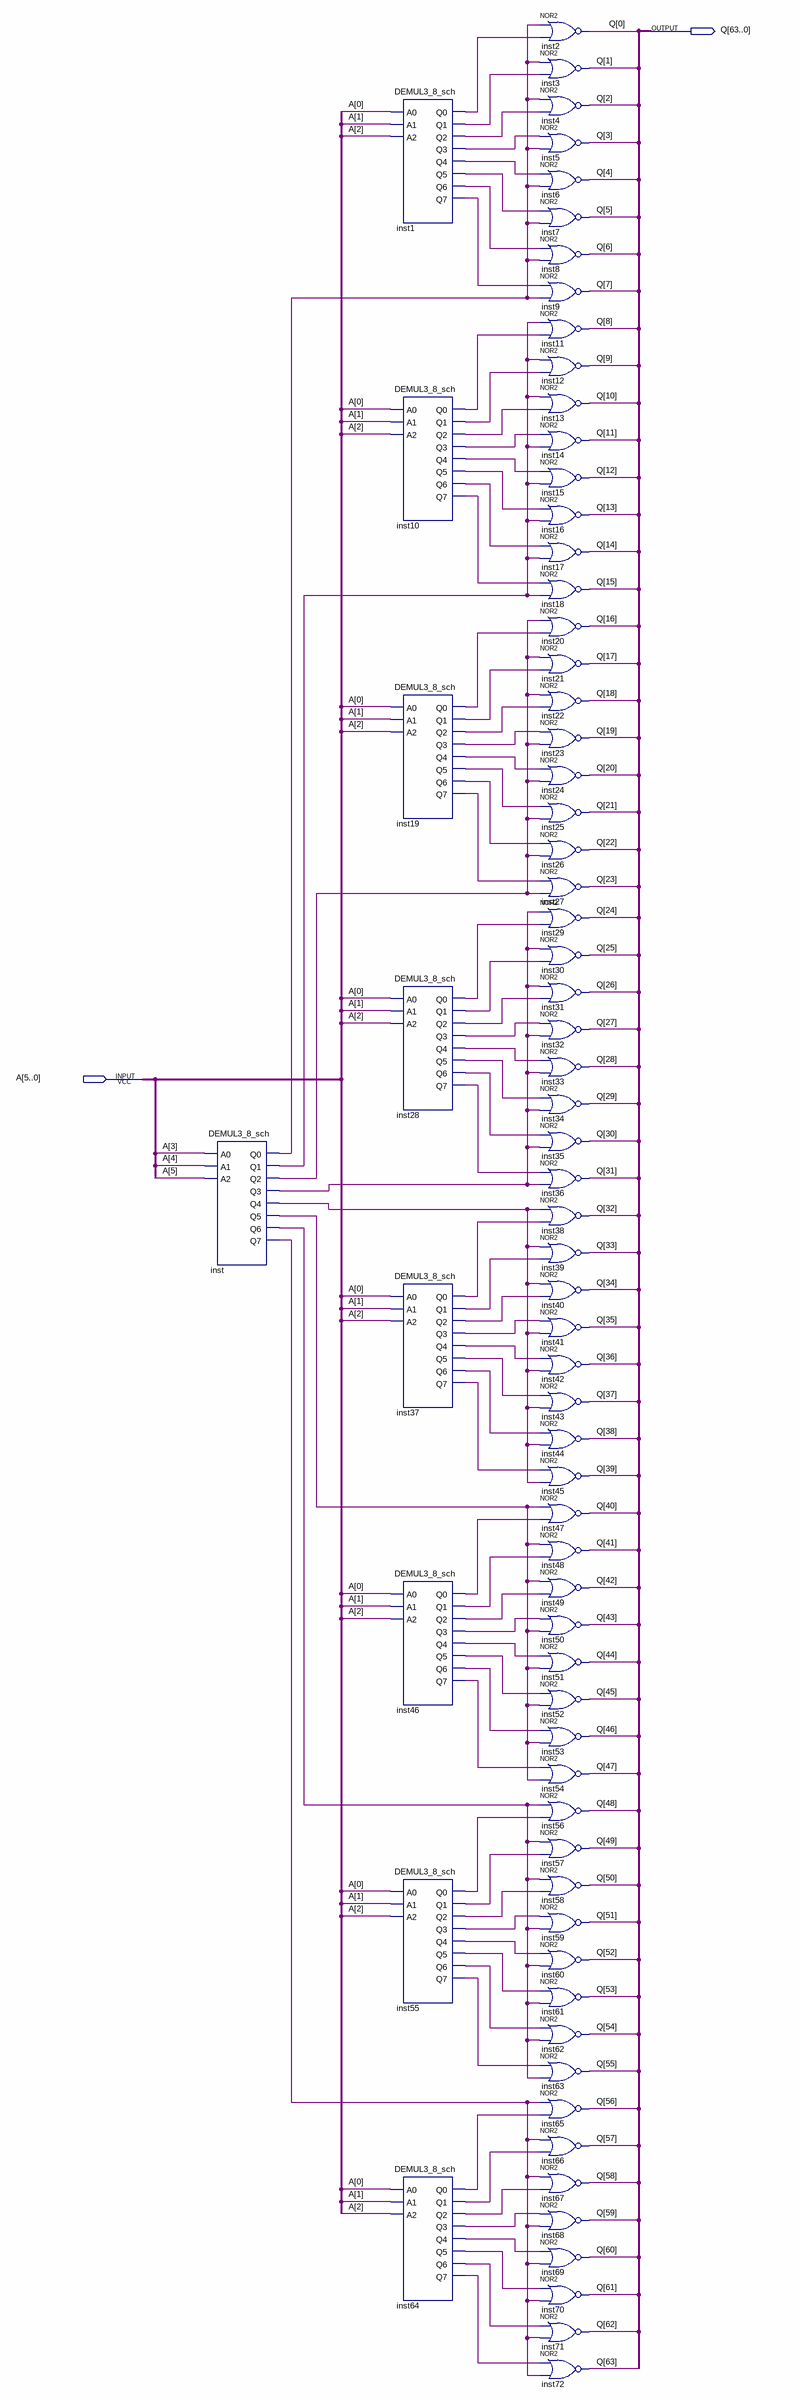
[diagram p0: schematic sheet]
// Quartus schematic Decoder_6_64.bdf as structural Verilog: 73 symbols, 2 pins
module Decoder_6_64 (
  input  [5:0] A,
  output [63:0] Q
);

  wire inst1_q0, inst1_q1, inst1_q2, inst1_q3, inst1_q4, inst1_q5, inst1_q6, inst1_q7, inst10_q0, inst10_q1,
       inst10_q2, inst10_q3, inst10_q4, inst10_q5, inst10_q6, inst10_q7, inst19_q0, inst19_q1, inst19_q2,
       inst19_q3, inst19_q4, inst19_q5, inst19_q6, inst19_q7, inst28_q0, inst28_q1, inst28_q2, inst28_q3,
       inst28_q4, inst28_q5, inst28_q6, inst28_q7, inst37_q0, inst37_q1, inst37_q2, inst37_q3, inst37_q4,
       inst37_q5, inst37_q6, inst37_q7, inst46_q0, inst46_q1, inst46_q2, inst46_q3, inst46_q4, inst46_q5,
       inst46_q6, inst46_q7, inst55_q0, inst55_q1, inst55_q2, inst55_q3, inst55_q4, inst55_q5, inst55_q6,
       inst55_q7, inst64_q0, inst64_q1, inst64_q2, inst64_q3, inst64_q4, inst64_q5, inst64_q6, inst64_q7,
       inst_q0, inst_q1, inst_q2, inst_q3, inst_q4, inst_q5, inst_q6, inst_q7;

  DEMUL3_8_sch inst (
    .A0(A[3]), .A1(A[4]), .A2(A[5]), .Q0(inst_q0), .Q1(inst_q1), .Q2(inst_q2), .Q3(inst_q3), .Q4(inst_q4),
    .Q5(inst_q5), .Q6(inst_q6), .Q7(inst_q7));
  DEMUL3_8_sch inst1 (
    .A0(A[0]), .A1(A[1]), .A2(A[2]), .Q0(inst1_q0), .Q1(inst1_q1), .Q2(inst1_q2), .Q3(inst1_q3),
    .Q4(inst1_q4), .Q5(inst1_q5), .Q6(inst1_q6), .Q7(inst1_q7));
  DEMUL3_8_sch inst10 (
    .A0(A[0]), .A1(A[1]), .A2(A[2]), .Q0(inst10_q0), .Q1(inst10_q1), .Q2(inst10_q2), .Q3(inst10_q3),
    .Q4(inst10_q4), .Q5(inst10_q5), .Q6(inst10_q6), .Q7(inst10_q7));
  DEMUL3_8_sch inst19 (
    .A0(A[0]), .A1(A[1]), .A2(A[2]), .Q0(inst19_q0), .Q1(inst19_q1), .Q2(inst19_q2), .Q3(inst19_q3),
    .Q4(inst19_q4), .Q5(inst19_q5), .Q6(inst19_q6), .Q7(inst19_q7));
  DEMUL3_8_sch inst28 (
    .A0(A[0]), .A1(A[1]), .A2(A[2]), .Q0(inst28_q0), .Q1(inst28_q1), .Q2(inst28_q2), .Q3(inst28_q3),
    .Q4(inst28_q4), .Q5(inst28_q5), .Q6(inst28_q6), .Q7(inst28_q7));
  DEMUL3_8_sch inst37 (
    .A0(A[0]), .A1(A[1]), .A2(A[2]), .Q0(inst37_q0), .Q1(inst37_q1), .Q2(inst37_q2), .Q3(inst37_q3),
    .Q4(inst37_q4), .Q5(inst37_q5), .Q6(inst37_q6), .Q7(inst37_q7));
  DEMUL3_8_sch inst46 (
    .A0(A[0]), .A1(A[1]), .A2(A[2]), .Q0(inst46_q0), .Q1(inst46_q1), .Q2(inst46_q2), .Q3(inst46_q3),
    .Q4(inst46_q4), .Q5(inst46_q5), .Q6(inst46_q6), .Q7(inst46_q7));
  DEMUL3_8_sch inst55 (
    .A0(A[0]), .A1(A[1]), .A2(A[2]), .Q0(inst55_q0), .Q1(inst55_q1), .Q2(inst55_q2), .Q3(inst55_q3),
    .Q4(inst55_q4), .Q5(inst55_q5), .Q6(inst55_q6), .Q7(inst55_q7));
  DEMUL3_8_sch inst64 (
    .A0(A[0]), .A1(A[1]), .A2(A[2]), .Q0(inst64_q0), .Q1(inst64_q1), .Q2(inst64_q2), .Q3(inst64_q3),
    .Q4(inst64_q4), .Q5(inst64_q5), .Q6(inst64_q6), .Q7(inst64_q7));
  nor inst2 (Q[0], inst_q0, inst1_q0);
  nor inst3 (Q[1], inst_q0, inst1_q1);
  nor inst4 (Q[2], inst_q0, inst1_q2);
  nor inst5 (Q[3], inst1_q3, inst_q0);
  nor inst6 (Q[4], inst1_q4, inst_q0);
  nor inst7 (Q[5], inst1_q5, inst_q0);
  nor inst8 (Q[6], inst1_q6, inst_q0);
  nor inst9 (Q[7], inst1_q7, inst_q0);
  nor inst11 (Q[8], inst_q1, inst10_q0);
  nor inst12 (Q[9], inst_q1, inst10_q1);
  nor inst13 (Q[10], inst_q1, inst10_q2);
  nor inst14 (Q[11], inst10_q3, inst_q1);
  nor inst15 (Q[12], inst10_q4, inst_q1);
  nor inst16 (Q[13], inst10_q5, inst_q1);
  nor inst17 (Q[14], inst10_q6, inst_q1);
  nor inst18 (Q[15], inst10_q7, inst_q1);
  nor inst20 (Q[16], inst_q2, inst19_q0);
  nor inst21 (Q[17], inst_q2, inst19_q1);
  nor inst22 (Q[18], inst_q2, inst19_q2);
  nor inst23 (Q[19], inst19_q3, inst_q2);
  nor inst24 (Q[20], inst19_q4, inst_q2);
  nor inst25 (Q[21], inst19_q5, inst_q2);
  nor inst26 (Q[22], inst19_q6, inst_q2);
  nor inst27 (Q[23], inst19_q7, inst_q2);
  nor inst29 (Q[24], inst_q3, inst28_q0);
  nor inst30 (Q[25], inst_q3, inst28_q1);
  nor inst31 (Q[26], inst_q3, inst28_q2);
  nor inst32 (Q[27], inst28_q3, inst_q3);
  nor inst33 (Q[28], inst28_q4, inst_q3);
  nor inst34 (Q[29], inst28_q5, inst_q3);
  nor inst35 (Q[30], inst28_q6, inst_q3);
  nor inst36 (Q[31], inst28_q7, inst_q3);
  nor inst38 (Q[32], inst_q4, inst37_q0);
  nor inst39 (Q[33], inst_q4, inst37_q1);
  nor inst40 (Q[34], inst_q4, inst37_q2);
  nor inst41 (Q[35], inst37_q3, inst_q4);
  nor inst42 (Q[36], inst37_q4, inst_q4);
  nor inst43 (Q[37], inst37_q5, inst_q4);
  nor inst44 (Q[38], inst37_q6, inst_q4);
  nor inst45 (Q[39], inst37_q7, inst_q4);
  nor inst47 (Q[40], inst_q5, inst46_q0);
  nor inst48 (Q[41], inst_q5, inst46_q1);
  nor inst49 (Q[42], inst_q5, inst46_q2);
  nor inst50 (Q[43], inst46_q3, inst_q5);
  nor inst51 (Q[44], inst46_q4, inst_q5);
  nor inst52 (Q[45], inst46_q5, inst_q5);
  nor inst53 (Q[46], inst46_q6, inst_q5);
  nor inst54 (Q[47], inst46_q7, inst_q5);
  nor inst56 (Q[48], inst_q6, inst55_q0);
  nor inst57 (Q[49], inst_q6, inst55_q1);
  nor inst58 (Q[50], inst_q6, inst55_q2);
  nor inst59 (Q[51], inst55_q3, inst_q6);
  nor inst60 (Q[52], inst55_q4, inst_q6);
  nor inst61 (Q[53], inst55_q5, inst_q6);
  nor inst62 (Q[54], inst55_q6, inst_q6);
  nor inst63 (Q[55], inst55_q7, inst_q6);
  nor inst65 (Q[56], inst_q7, inst64_q0);
  nor inst66 (Q[57], inst_q7, inst64_q1);
  nor inst67 (Q[58], inst_q7, inst64_q2);
  nor inst68 (Q[59], inst64_q3, inst_q7);
  nor inst69 (Q[60], inst64_q4, inst_q7);
  nor inst70 (Q[61], inst64_q5, inst_q7);
  nor inst71 (Q[62], inst64_q6, inst_q7);
  nor inst72 (Q[63], inst64_q7, inst_q7);
endmodule
